# EAGLE design rapidshark_mark_7 (EAGLE 6.5.0)
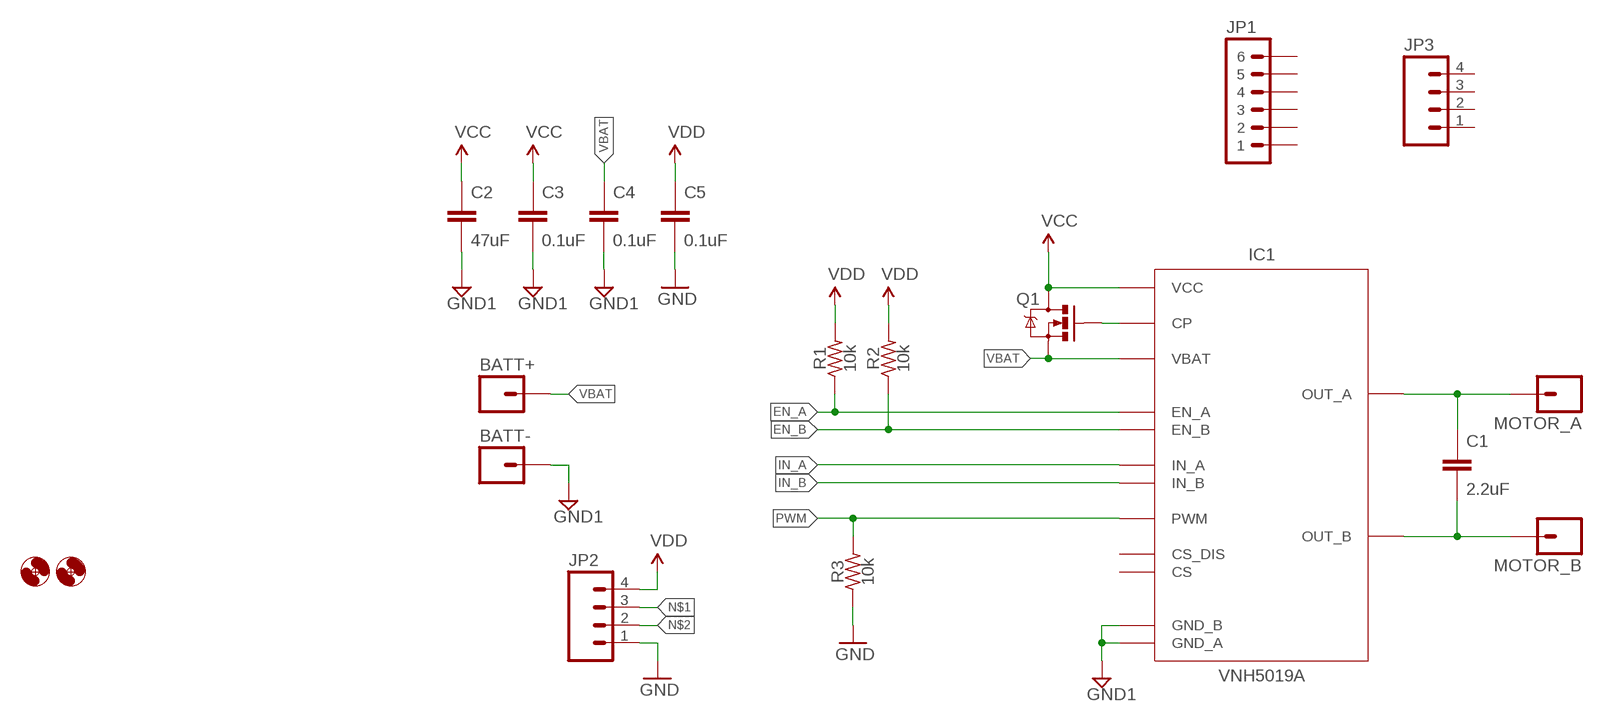
[diagram p0: schematic, sheet 1]

## Parts
BATT+  M01PTH_2MM  [1X01_2MM]
BATT-  M01PTH_2MM  [1X01_2MM]
C1  2.2uF  CAPACITOR-CERAMICC1206  [C1206]
C2  47uF  CAPACITOR-CERAMICC3216  [C3216]
C3  0.1uF  CAPACITOR-CERAMICC0603  [C0603]
C4  0.1uF  CAPACITOR-CERAMICC0805  [C0805]
C5  0.1uF  CAPACITOR-CERAMICC0603  [C0603]
H1  HOLE#2  [HOLE-#2]
H2  HOLE#2  [HOLE-#2]
IC1  VNH5019A  [VNH5019A]
JP1  M06JST-ZH-SMD-RA  [JST-6-ZH-RA-SMD]
JP2  M04JST-PTH  [JST-4-PH-RA-PTH]
JP3  M04JST-SH-SMD-RA  [1X04-JST-SH-1MM-SMT-RA]
MOTOR_A  M01PTH_2MM  [1X01_2MM]
MOTOR_B  M01PTH_2MM  [1X01_2MM]
Q1  PSMN4R0-30YLD  MOSFET-NCHANNELPSMN4R0-30YLD  [LFPAK56]
R1  10k  RESISTORR0603  [R0603]
R2  10k  RESISTORR0603  [R0603]
R3  10k  RESISTORR0603  [R0603]

## Nets
EN_A: IC1.5(EN_A) R1.1
EN_B: IC1.9(EN_B) R2.1
GND: C5.2 JP2.1 R3.1
GND1: BATT-.1 C2.2 C3.2 C4.2 IC1.17(GND_A) IC1.18(GND_B) IC1.19(GND_B) IC1.20(GND_B) IC1.26(GND_A) IC1.27(GND_A) IC1.28(GND_A) IC1.29(GND_A)
IN_A: IC1.4(IN_A)
IN_B: IC1.10(IN_B)
MOTOR_A: C1.1 IC1.1(OUT_A) IC1.24(OUT_A) IC1.25(OUT_A) IC1.30(OUT_A) IC1.HS2(OUT_A) MOTOR_A.1
MOTOR_B: C1.2 IC1.15(OUT_B) IC1.16(OUT_B) IC1.21(OUT_B) IC1.22(OUT_B) IC1.HS3(OUT_B) MOTOR_B.1
N$1: JP2.3
N$2: JP2.2
N$3: IC1.11(CP) Q1.4(G)
PWM: IC1.7(PWM) R3.2
VBAT: BATT+.1 C4.1 IC1.12(VBAT) Q1.1(S) Q1.2(S) Q1.3(S)
VCC: C2.1 C3.1 IC1.2(VCC) IC1.3(VCC) IC1.13(VCC) IC1.14(VCC) IC1.23(VCC) IC1.HS1(VCC) Q1.MB@1(D) Q1.MB@2(D)
VDD: C5.1 JP2.4 R1.2 R2.2
Unconnected: IC1.6(CS_DIS) IC1.8(CS) JP1.1 JP1.2 JP1.3 JP1.4 JP1.5 JP1.6 JP3.1 JP3.2 JP3.3 JP3.4

## Library data of the parts
BATT+ BATT- MOTOR_A MOTOR_B = A_butts:M01: Header 1 Standard 1-pin 0.1" header. Use with straight break away headers (SKU : PRT-00116), right angle break away headers (PRT-00553), swiss pins (PRT-00743), machine pins (PRT-00117), and female headers (PRT-00115).
C1-C5 = A_butts:CAPACITOR-CERAMIC: CAPACITOR, European symbol
H1 H2 = A_butts:HOLE: MOUNTING HOLE with drill center marker
IC1 = A_butts:VNH5019A
JP1 = A_butts:M06: Header 6 Standard 6-pin 0.1" header. Use with straight break away headers (SKU : PRT-00116), right angle break away headers (PRT-00553), swiss pins (PRT-00743), machine pins (PRT-00117), and female headers (PRT-00115). Molex polarized connector foot print use with SKU : PRT-08094 with associated crimp pins and housings. NOTES ON THE VARIANTS LOCK and LOCK_LONGPADS... This footprint was designed to help hold the alignment of a through-hole component (i.e. 6-pin header) while soldering it into place. You may notice that each hole has been shifted either up or down by 0.005 of an inch from it's more standard position (which is a perfectly straight line). This slight alteration caused the pins (the squares in the middle) to touch the edges of the holes. Because they are alternating, it causes a "brace" to hold the component in place. 0.005 has proven to be the perfect amount of "off-center" position when using our standard breakaway headers. Although looks a little odd when you look at the bare footprint, once you have a header in there, the alteration is very hard to notice. Also,if you push a header all the way into place, it is covered up entirely on the bottom side. This idea of altering the position of holes to aid alignment will be further integrated into the Sparkfun Library for other footprints. It can help hold any component with 3 or more connection pins.
JP2 = A_butts:M04: Header 4 Standard 4-pin 0.1" header. Use with straight break away headers (SKU : PRT-00116), right angle break away headers (PRT-00553), swiss pins (PRT-00743), machine pins (PRT-00117), and female headers (PRT-00115). Molex polarized connector foot print use with SKU : PRT-08231 with associated crimp pins and housings. 1MM SMD Version SKU: PRT-10208; SKU: PRT-09916
JP3 = A_butts:M04: Header 4 Standard 4-pin 0.1" header. Use with straight break away headers (SKU : PRT-00116), right angle break away headers (PRT-00553), swiss pins (PRT-00743), machine pins (PRT-00117), and female headers (PRT-00115). Molex polarized connector foot print use with SKU : PRT-08231 with associated crimp pins and housings. 1MM SMD Version SKU: PRT-10208
Q1 = A_butts:MOSFET-NCHANNEL: Common NMOSFET Parts MFG P/N Store ID Prod ID FDD8780 TRANS-09984 SI7820DN TRANS-11055 FDS6630A IC-08089 2N7002PW TRANS-11151 FQP30N06L COM-10213 TRANS-10060 BSS123LT1G TRANS-08345 BSS138 TRANS-00830 BS170 2N7000
R1-R3 = A_butts:RESISTOR: RESISTOR, American symbol

## Board
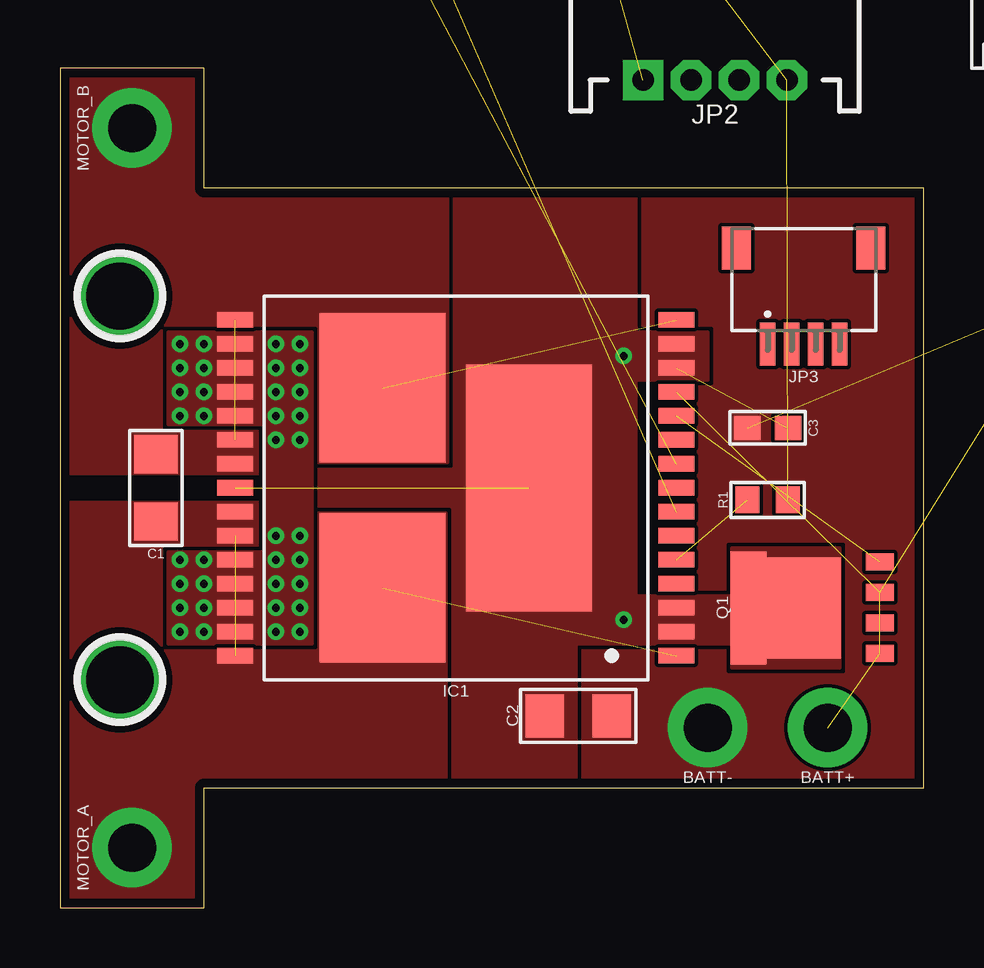
[diagram p1: board, top side]
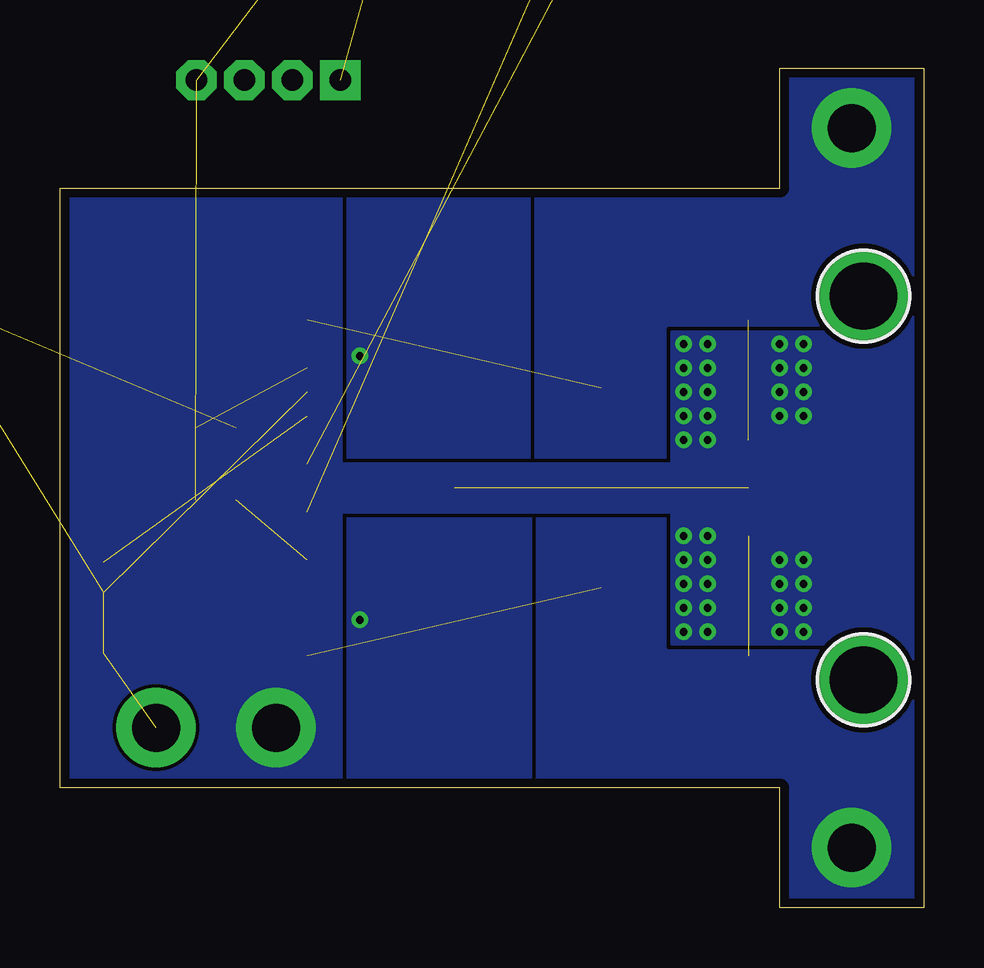
[diagram p2: board, bottom side, seen from below]

Size 36 x 35 mm. Coordinates in mm from the lower left corner, seen from the top.
Outline: 36,30 6,30 6,35 0,35 0,0 6,0 6,5 36,5 36,30
Copper layers (1*16): Top 0.0356mm / dielectric 1.5011mm / Bottom 0.0356mm
Design rules "LaenPCBOrder_2": minimum track width 6mil, minimum drill 13mil, track to track 6mil, track to pad 6mil, pad to pad 6mil, via to via 6mil, smd to smd 6mil, copper to edge 15mil, drill to drill 6mil, minimum pad ring 7mil, minimum via ring 7mil, stop-mask expansion 3mil, vias tented up to drill 20mil, thermal gap 10mil

### Footprints (pad centres in the part's own frame; a part is rotated, then mirrored left to right if it is on the bottom)
1X01_2MM = drill 2 pad 3.302: 1 0,0
C1206 = smd 1.6 x 1.8: 1 -1.4,0; 2 1.4,0
C3216 = smd 1.6 x 1.8: 1 -1.4,0; 2 1.4,0
C0603 = smd 1.1 x 1: 1 -0.85,0; 2 0.85,0
C0805 = smd 1.3 x 1.5: 1 -0.95,0; 2 0.95,0
HOLE-#2 = drill 2.8 pad 3.81: P$1 0,0
VNH5019A = smd 1.5 x 0.65: 1 -9.2,7; 2 -9.2,6; 3 -9.2,5; 4 -9.2,4; 5 -9.2,3; 6 -9.2,2; 7 -9.2,1; 8 -9.2,0; 9 -9.2,-1; 10 -9.2,-2; 11 -9.2,-3; 12 -9.2,-4; 13 -9.2,-5; 14 -9.2,-6; 15 -9.2,-7; 16 9.2,-7; 17 9.2,-6; 18 9.2,-5; 19 9.2,-4; 20 9.2,-3; 21 9.2,-2; 22 9.2,-1; 23 9.2,0; 24 9.2,1; 25 9.2,2; 26 9.2,3; 27 9.2,4; 28 9.2,5; 29 9.2,6; 30 9.2,7 | smd 5.25 x 10.3: HS1 -3.05,0 | smd 5.25 x 6.23: HS2 3.05,4.165; HS3 3.05,-4.165
JST-6-ZH-RA-SMD = smd 0.9 x 3: 1 3.75,-0.8; 2 2.25,-0.8; 3 0.75,-0.8; 4 -0.75,-0.8; 5 -2.25,-0.8; 6 -3.75,-0.8 | smd 1.1 x 1.9: G@1 -5.7,3.05; G@2 5.7,3.05
JST-4-PH-RA-PTH = drill 0.9 pad 1.676 square: 1 0,0 | drill 0.9 pad 1.676 octagon: 2 2,0; 3 4,0; 4 6,0
1X04-JST-SH-1MM-SMT-RA = smd 0.65 x 1.8: 1 -1.5,0; 2 -0.5,0; 3 0.5,0; 4 1.5,0 | smd 1.2 x 1.8: ANCHOR1 -2.8,4; ANCHOR2 2.8,4
LFPAK56 = smd 0.7 x 1.15: 1 -1.905,-3.175; 2 -0.635,-3.175; 3 0.635,-3.175; 4 1.905,-3.175 | smd 4.2 x 3.1: MB@1 0,0 | smd 4.7 x 1.5: MB@2 0,2.3
R0603 = smd 1 x 1.1: 1 -0.85,0; 2 0.85,0

### Placement (x,y rotation side)
BATT+  32,7.5 180 top
BATT-  27,7.5 180 top
C1  4,17.5 90 top
C2  21.6,8 0 top
C3  29.5,20 180 top
C4  43.5,26.62 0 top  (outside the outline)
C5  19,50.5 0 top  (outside the outline)
H1  2.5,25.5 180 top
H2  2.5,9.5 180 top
IC1  16.5,17.5 180 top
JP1  44,36 0 top
JP2  24.31,34.5 0 top
JP3  31,23.5 0 top
MOTOR_A  3,2.5 90 top
MOTOR_B  3,32.5 90 top
Q1  31,12.5 90 top
R1  29.5,17 0 top
R2  9.5,50 90 top  (outside the outline)
R3  11.5,50 270 top  (outside the outline)

### Tracks (layer width: path | path; a pad name or v marks a point on that pad's centre or on a via)
EN_A  (1 unrouted)
EN_B  (1 unrouted)
GND  (2 unrouted)
GND1  (via drill 0.33)  (1 unrouted)
  other vias: 10,11.5 9,11.5 10,12.5 10,13.5 10,14.5 10,15.5 9,12.5 9,13.5 9,14.5 9,15.5 6,11.5 5,11.5 6,12.5 6,13.5 6,14.5 5,12.5 5,13.5 5,14.5 10,19.5 9,19.5 10,20.5 10,21.5 10,22.5 10,23.5 9,20.5 9,21.5 9,22.5 9,23.5 6,20.5 5,20.5 6,21.5 6,22.5 6,23.5 5,21.5 5,22.5 5,23.5
  pour Top (isolate 0.152, no thermals): 10.5,11 10.5,24 4.5,24 4.5,20.15 8.5,20.15 8.5,14.83 4.5,14.83 4.5,11
  pour Bottom (isolate 0.152, no thermals): 10.5,11 10.5,24 4.5,24 4.5,11
  pour Bottom (isolate 0.152, rank 2, no thermals): 10,16.5 10,18.5 30,18.5 30,16.5
  pour Bottom (isolate 0.152, rank 6, no thermals): 36,30 36,5 0,5 0,30
  pour Top (isolate 0.152, rank 6, no thermals): 36,5 36,30 21.5,30 21.5,5
MOTOR_A  (2 unrouted)
  pour Top (isolate 0.152, rank 2, no thermals): 16.1,16.45 16.1,5 6,5 6,0 0,0 0,16.9 10,16.9 10,16.45
  pour Bottom (isolate 0.152, rank 3, no thermals): 16.1,17.45 16.1,5 6,5 6,0 0,0 0,16.9 10,16.9 10,17.45
MOTOR_B  (2 unrouted)
  pour Top (isolate 0.152, rank 2, no thermals): 16.15,18.55 16.15,30 6,30 6,35 0,35 0,18.1 9.5,18.1 9.5,18.55
  pour Bottom (isolate 0.152, rank 3, no thermals): 16.15,17.55 16.15,30 6,30 6,35 0,35 0,18.1 10,18.1 10,17.55
N$3  (1 unrouted)
PWM  (1 unrouted)
VBAT  (5 unrouted)
VCC  (via drill 0.33)  (2 unrouted)
  other vias: 23.5,23 23.5,12
  pour Top (rank 5, no thermals): 9.5,5 21.5,5 21.5,11 28,11 28,10 32.5,10 32.5,15 28,15 28,13 24,13 24,22 27,22 27,24 24,24 24,30 9.5,30
  pour Bottom (rank 5, no thermals): 15,5 24,5 24,30 15,30
VDD  (3 unrouted)